# EAGLE design v2_power_board (EAGLE 9.6.2)
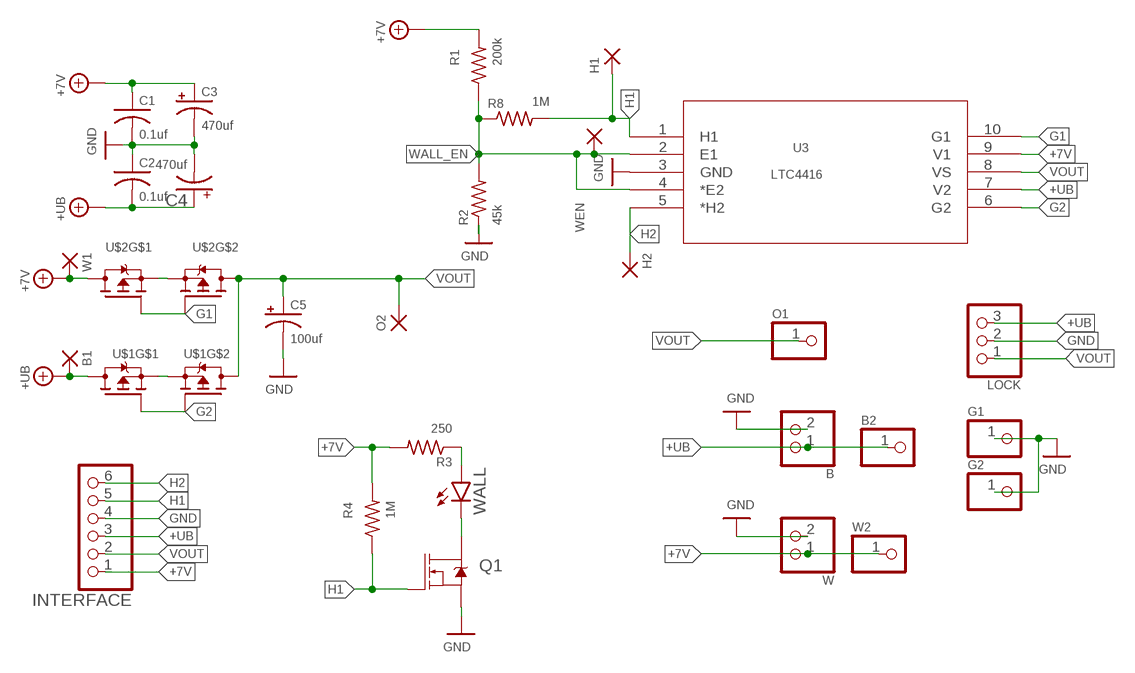
[diagram p0: schematic, sheet 1]

## Parts
B  PINHD-1X2  [1X02]
B1  SMD2  [SMD1,27-2,54]
B2  PINHD-1X1  [1X01]
C1  0.1uf  C-USC0805  [C0805]
C2  0.1uf  C-USC0805  [C0805]
C3  470uf  CPOL-US140CLH-0810  [140CLH-0810]
C4  470uf  CPOL-US140CLH-0810  [140CLH-0810]
C5  100uf  CPOL-US140CLH-0810  [140CLH-0810]
G1  PINHD-1X1  [1X01]
G2  PINHD-1X1  [1X01]
H1  SMD2  [SMD1,27-2,54]
H2  SMD2  [SMD1,27-2,54]
INTERFACE  PINHD-1X6  [1X06]
LOCK  PINHD-1X3  [1X03]
O1  PINHD-1X1  [1X01]
O2  SMD2  [SMD1,27-2,54]
Q1  310mA/60V/1.6Ω  MOSFET-NCH-2N7002PW  [SOT323]
R1  200k  R-US_R0805  [R0805]
R2  45k  R-US_R0805  [R0805]
R3  250  R-US_R0805  [R0805]
R4  1M  R-US_R0805  [R0805]
R8  1M  R-US_R0805  [R0805]
U3  LTC4416  LTC4416IMS#PBF  [MSOP-10_MS]
U$1  IRF7314PBF  [SO-8]
U$2  IRF7314PBF  [SO-8]
W  PINHD-1X2  [1X02]
W1  SMD2  [SMD1,27-2,54]
W2  PINHD-1X1  [1X01]
WALL  LEDSML0805  [SML0805]
WEN  SMD2  [SMD1,27-2,54]

## Nets
+7V: C1.1 C3.+ INTERFACE.1 R1.2 R3.2 R4.2 U3.9(V1) U$2.7(D) U$2.8(D) W1.1(P) W2.1 W.1
+UB: B1.1(P) B2.1 B.1 C2.2 C4.+ INTERFACE.3 LOCK.3 U3.7(V2) U$1.7(D) U$1.8(D)
G1: U3.10(G1) U$2.2(G) U$2.4(G)
G2: U3.6(G2) U$1.2(G) U$1.4(G)
GND: B.2 C1.2 C2.1 C3.- C4.- C5.- G1.1 G2.1 INTERFACE.4 LOCK.2 Q1.2(S) R2.1 U3.3(GND) W.2
H1: H1.1(P) INTERFACE.5 Q1.1(G) R4.1 R8.2 U3.1(H1)
H2: H2.1(P) INTERFACE.6 U3.5(*H2)
N$1: R3.1 WALL.A
N$2: Q1.3(D) WALL.C
N$3: U$1.1(S) U$1.3(S)
N$4: U$2.1(S) U$2.3(S)
VOUT: C5.+ INTERFACE.2 LOCK.1 O1.1 O2.1(P) U3.8(VS) U$1.5(D) U$1.6(D) U$2.5(D) U$2.6(D)
WALL_EN: R1.1 R2.2 R8.1 U3.2(E1) U3.4(*E2) WEN.1(P)

## Library data of the parts
B W = pinhead:PINHD-1X2: PIN HEADER
B1 H1 H2 O2 W1 WEN = wirepad:SMD2: SMD PAD
B2 G1 G2 O1 W2 = pinhead:PINHD-1X1: PIN HEADER
C1 C2 = rcl:C-US: CAPACITOR, American symbol; SPICEPREFIX: C
C3-C5 = rcl:CPOL-US: POLARIZED CAPACITOR, American symbol; SPICEPREFIX: C
INTERFACE = pinhead:PINHD-1X6: PIN HEADER
LOCK = pinhead:PINHD-1X3: PIN HEADER
Q1 = SparkFun-DiscreteSemi:MOSFET-NCH: N-channel MOSFETs Voltage controlled devices that allow control of high current outputs. SparkFun Products: SparkFun OpenScale <https://www.sparkfun.com/products/13261> SparkFun Digital Sandbox <https://www.sparkfun.com/products/12651> SparkFun Monster Moto Shield <https://www.sparkfun.com/products/10182> SparkFun MOSFET Power Controller <https://www.sparkfun.com/products/11214>; PROD_ID: TRANS-11151
R1-R4 R8 = rcl:R-US_: RESISTOR, American symbol; SPICEPREFIX: R
U3 = LTC4416IMS_PBF:LTC4416IMS#PBF: Check availability <https://pricing.snapeda.com/parts/LTC4416IMS%23PBF/Analog%20Devices/view-part?ref=eda>; AVAILABILITY: In Stock; DESCRIPTION: OR Controller Source Selector Switch P-Channel 2:2 10-MSOP; MF: Analog Devices; MP: LTC4416IMS#PBF; PACKAGE: MSOP-10 Linear Technology; PRICE: None; PURCHASE-URL: https://pricing.snapeda.com/search/part/LTC4416IMS#PBF/?ref=eda
U$1 U$2 = IRF7314PBF:IRF7314PBF: Check availability <https://pricing.snapeda.com/parts/IRF7314PBF/Infineon/view-part?ref=eda>; AVAILABILITY: In Stock; DESCRIPTION: Mosfet Array 2 P-Channel (Dual) 20V 5.3A 2W Surface Mount 8-SO; MF: Infineon; MP: IRF7314PBF; PACKAGE: SOIC-8 International Rectifier; PRICE: None; PURCHASE-URL: https://pricing.snapeda.com/search/part/IRF7314PBF/?ref=eda
WALL = led:LED: LED OSRAM: - CHIPLED LG R971, LG N971, LY N971, LG Q971, LY Q971, LO R971, LY R971 LH N974, LH R974 LS Q976, LO Q976, LY Q976 LO Q996 - Hyper CHIPLED LW Q18S LB Q993, LB Q99A, LB R99A - SideLED LS A670, LO A670, LY A670, LG A670, LP A670 LB A673, LV A673, LT A673, LW A673 LH A674 LY A675 LS A676, LA A676, LO A676, LY A676, LW A676 LS A679, LY A679, LG A679 - Hyper Micro SIDELED® LS Y876, LA Y876, LO Y876, LY Y876 LT Y87S - SmartLED LW L88C, LW L88S LB L89C, LB L89S, LG L890 LS L89K, LO L89K, LY L89K LS L896, LA L896, LO L896, LY L896 - TOPLED LS T670, LO T670, LY T670, LG T670, LP T670 LSG T670, LSP T670, LSY T670, LOP T670, LYG T670 LG T671, LOG T671, LSG T671 LB T673, LV T673, LT T673, LW T673 LH T674 LS T676, LA T676, LO T676, LY T676, LB T676, LH T676, LSB T676, LW T676 LB T67C, LV T67C, LT T67C, LS T67K, LO T67K, LY T67K, LW E67C LS E67B, LA E67B, LO E67B, LY E67B, LB E67C, LV E67C, LT E67C LW T67C LS T679, LY T679, LG T679 LS T770, LO T770, LY T770, LG T770, LP T770 LB T773, LV T773, LT T773, LW T773 LH T774 LS E675, LA E675, LY E675, LS T675 LS T776, LA T776, LO T776, LY T776, LB T776 LHGB T686 LT T68C, LB T68C - Hyper Mini TOPLED® LB M676 - Mini TOPLED Santana® LG M470 LS M47K, LO M47K, LY M47K Source: http://www.osram.convergy.de LUXEON: - LUMILED® LXK2-PW12-R00, LXK2-PW12-S00, LXK2-PW14-U00, LXK2-PW14-V00 LXK2-PM12-R00, LXK2-PM12-S00, LXK2-PM14-U00 LXK2-PE12-Q00, LXK2-PE12-R00, LXK2-PE12-S00, LXK2-PE14-T00, LXK2-PE14-U00 LXK2-PB12-K00, LXK2-PB12-L00, LXK2-PB12-M00, LXK2-PB14-N00, LXK2-PB14-P00, LXK2-PB14-Q00 LXK2-PR12-L00, LXK2-PR12-M00, LXK2-PR14-Q00, LXK2-PR14-R00 LXK2-PD12-Q00, LXK2-PD12-R00, LXK2-PD12-S00 LXK2-PH12-R00, LXK2-PH12-S00 LXK2-PL12-P00, LXK2-PL12-Q00, LXK2-PL12-R00 Source: www.luxeon.com KINGBRIGHT: KA-3528ASYC Source: www.kingbright.com

## Board
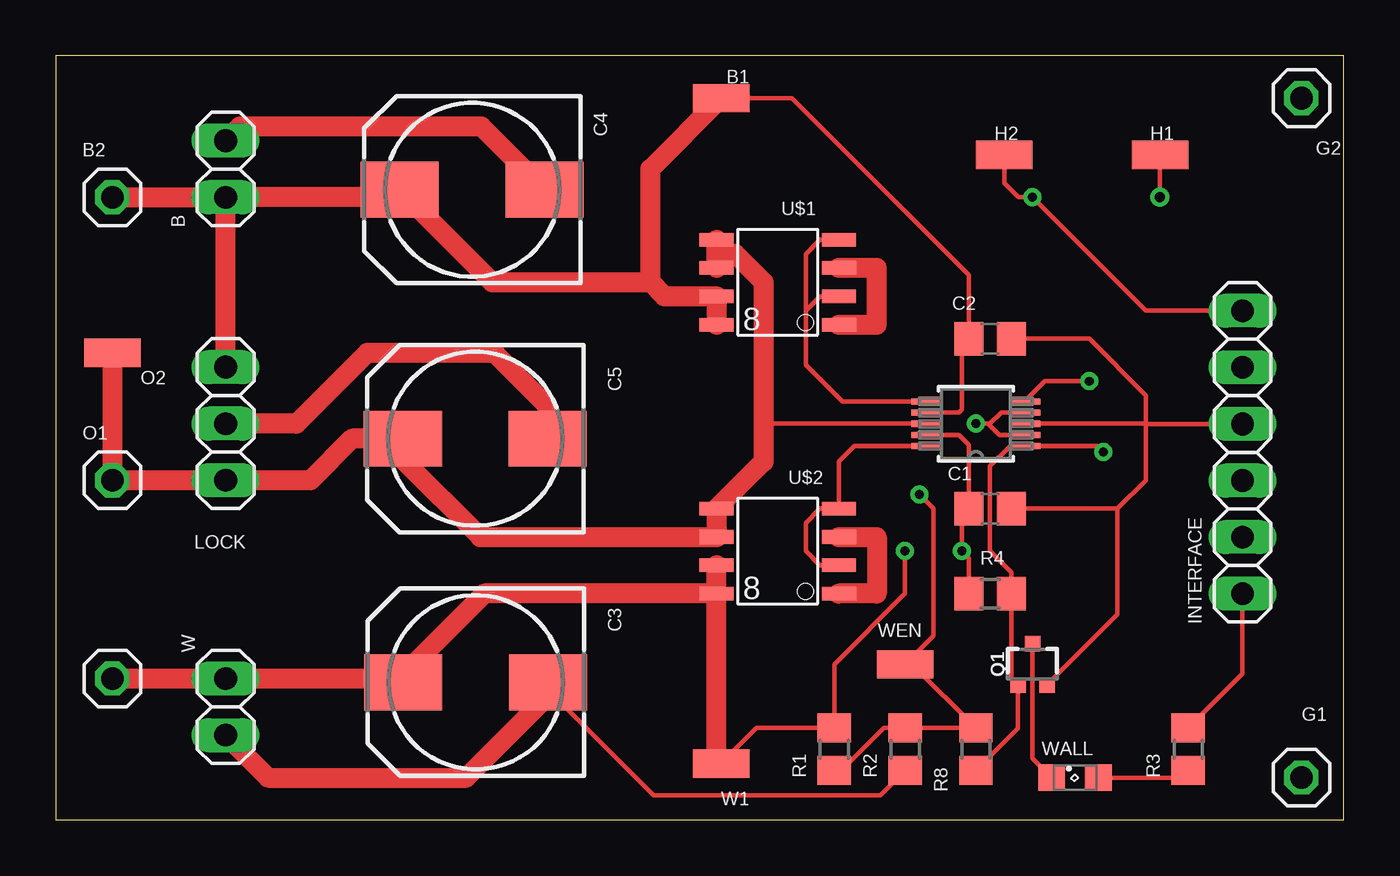
[diagram p1: board, top side]
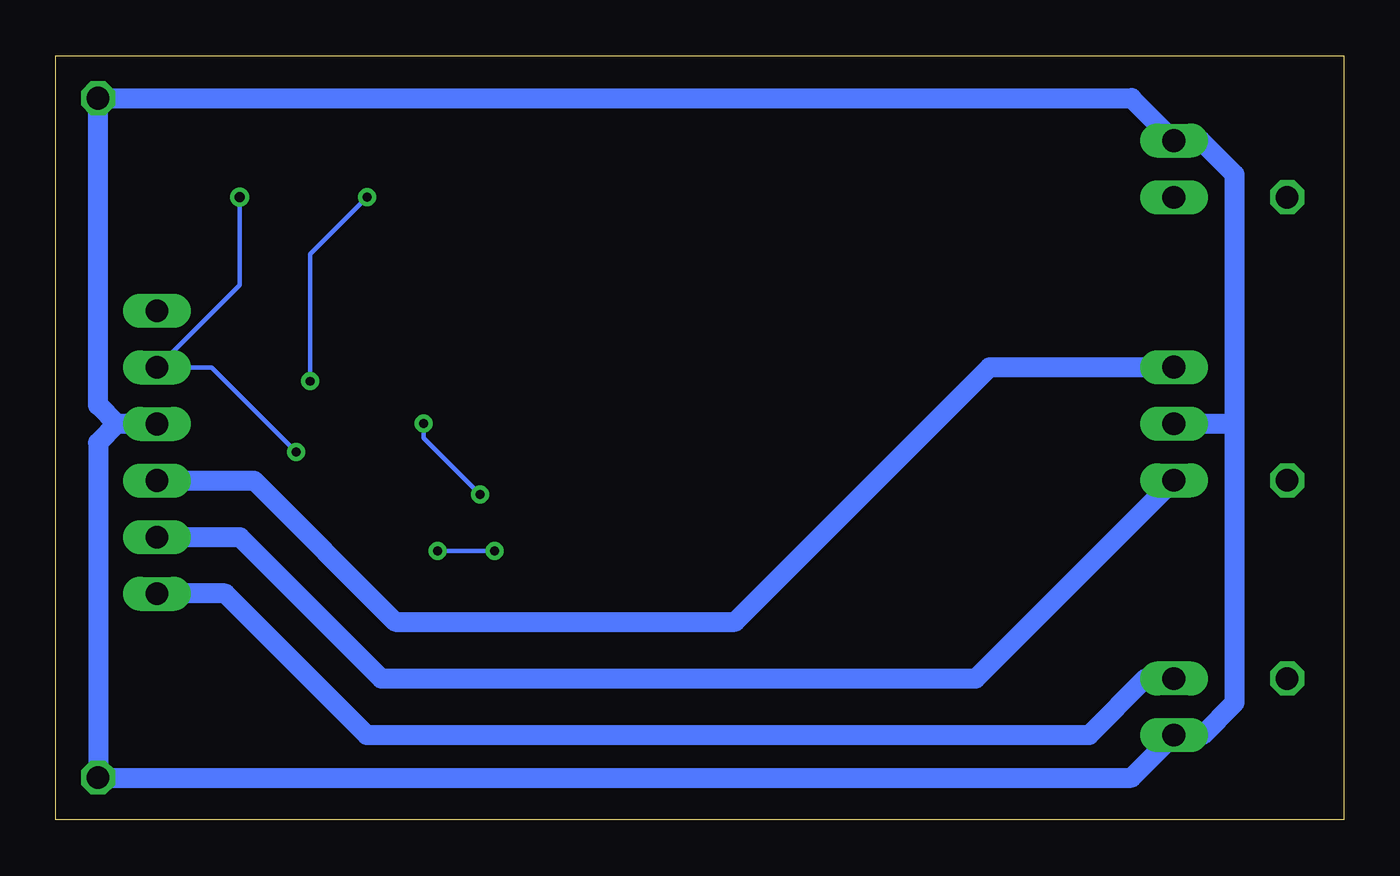
[diagram p2: board, bottom side, seen from below]

Size 57.77 x 34.29 mm. Coordinates in mm from the lower left corner, seen from the top.
Outline: 0,0 57.77,0 57.77,34.29 0,34.29 0,0
Copper layers (1*16): Top 0.035mm / dielectric 1.5mm / Bottom 0.035mm
Design rules "default": minimum track width 6mil, minimum drill 0.35mm, track to track 6mil, track to pad 6mil, pad to pad 6mil, via to via 6mil, smd to smd 6mil, copper to edge 40mil, drill to drill 6mil, minimum pad ring 10mil, minimum via ring 8mil, stop-mask expansion 4mil, vias tented up to drill 0mil, thermal gap 10mil

### Footprints (pad centres in the part's own frame; a part is rotated, then mirrored left to right if it is on the bottom)
1X02 = drill 1.016 long: 1 -1.27,0; 2 1.27,0
SMD1,27-2,54 = smd 1.27 x 2.54: 1 0,0
1X01 = drill 1.016 octagon: 1 0,0
C0805 = smd 1.3 x 1.5: 1 -0.95,0; 2 0.95,0
140CLH-0810 = smd 3.5 x 2.5: + 3.25,0; - -3.25,0
1X06 = drill 1.016 long: 1 -6.35,0; 2 -3.81,0; 3 -1.27,0; 4 1.27,0; 5 3.81,0; 6 6.35,0
1X03 = drill 1.016 long: 1 -2.54,0; 2 0,0; 3 2.54,0
SOT323 = smd 0.7 x 0.7: 1 -0.65,-0.925; 2 0.65,-0.925; 3 0,0.925
R0805 = smd 1.3 x 1.5: 1 -0.95,0; 2 0.95,0
MSOP-10_MS = smd 1.397 x 0.279: 1 -2.184,1.001; 2 -2.184,0.5; 3 -2.184,0; 4 -2.184,-0.5; 5 -2.184,-1.001; 6 2.184,-1.001; 7 2.184,-0.5; 8 2.184,0; 9 2.184,0.5; 10 2.184,1.001
SO-8 = smd 1.524 x 0.61: 1 -2.743,1.905; 2 -2.743,0.635; 3 -2.743,-0.635; 4 -2.743,-1.905; 5 2.743,-1.905; 6 2.743,-0.635; 7 2.743,0.635; 8 2.743,1.905
SML0805 = smd 1.2 x 1.2: A 1.05,0; C -1.05,0

### Placement (x,y rotation side)
B  7.62,29.21 90 top
B1  29.84,32.38 90 top
B2  2.54,27.94 0 top
C1  41.91,13.97 0 top
C2  41.91,21.59 180 top
C3  18.84,6.18 180 top
C4  18.68,28.28 180 top
C5  18.82,17.11 180 top
G1  55.88,1.91 0 top
G2  55.88,32.38 0 top
H1  49.53,29.84 90 top
H2  42.55,29.84 90 top
INTERFACE  53.23,16.5 90 top
LOCK  7.62,17.78 90 top
O1  2.54,15.24 0 top
O2  2.54,20.95 90 top
Q1  43.81,6.99 0 top
R1  34.92,3.17 90 top
R2  38.1,3.17 90 top
R3  50.8,3.17 90 top
R4  41.91,10.16 180 top
R8  41.27,3.17 270 top
U3  41.27,17.78 180 top
U$1  32.38,24.13 180 top
U$2  32.38,12.06 180 top
W  7.62,5.08 270 top
W1  29.84,2.54 90 top
W2  2.54,6.35 0 top
WALL  45.72,1.91 0 top
WEN  38.1,6.99 270 top

### Tracks (layer width: path | path; a pad name or v marks a point on that pad's centre or on a via)
+7V  (via drill 0.4)
  Top 0.203: W1.1 31.43,4.12 R1.2 34.92,6.99 38.1,10.16 v38.1,12.06 | R3.2 53.23,6.55 INTERFACE.1 | U3.9 40.51,17.28 40.96,16.82 C1.1 40.64,13.65 v40.64,12.06 40.96,11.74 R4.2
  Top 0.889: W2.1 W.1 15.42,6.35 | 15.42,6.35 C3.+ | 15.42,6.35 19.23,10.16 U$2.8 | W1.1 29.64,2.74 U$2.8 | U$2.8 U$2.7
  Bottom 0.203: v40.64,12.06 v38.1,12.06
  Bottom 0.889: W.1 8.89,6.35 11.43,3.81 43.81,3.81 50.16,10.16 INTERFACE.1
+UB
  Top 0.203: B1.1 33.02,32.38 40.96,24.45 C2.2 40.64,21.27 40.64,18.41 40.51,18.28 U3.7
  Top 0.889: B.1 15.09,27.94 C4.+ 19.58,24.13 26.67,24.13 | LOCK.3 B.1 | 26.67,24.13 26.67,29.21 B1.1 | B2.1 B.1 | U$1.8 U$1.7 27.3,23.5 26.67,24.13
  Bottom 0.889: LOCK.3 15.88,20.32 27.3,8.89 42.55,8.89 48.88,15.23 INTERFACE.3
G1
  Top 0.203: U$2.2 34.29,11.43 33.66,12.06 33.66,13.34 34.29,13.97 U$2.4 35.13,16.08 35.83,16.78 U3.10
G2
  Top 0.203: U3.6 35.28,18.78 33.66,20.41 33.66,22.86 | 33.66,22.86 34.29,23.5 U$1.2 | 33.66,22.86 33.66,25.4 34.29,26.04 U$1.4
GND
  Top 0.203: C2.1 46.35,21.59 48.9,19.05 48.9,17.78 | INTERFACE.4 48.91,17.77 48.9,17.78 | 48.9,17.78 U3.3 | 47.62,13.97 48.9,15.24 48.9,17.78 | C1.2 47.62,13.97 | R2.1 36.99,1.12 26.82,1.12 22.09,5.85 C3.- | Q1.2 47.62,9.22 47.62,13.97
  Top 0.889: C5.- 22.07,18.57 19.68,20.95 13.97,20.95 10.79,17.78 LOCK.2 | C4.- 19.09,31.11 8.26,31.11 B.2 | W.2 9.53,1.91 18.41,1.91 22.09,5.58 C3.-
  Bottom 0.889: 4.89,17.78 4.89,28.96 6.41,30.48 B.2 9.53,32.38 G2.1 55.88,18.62 55.03,17.77 | 4.89,17.78 4.89,5.27 6.35,3.81 W.2 9.53,1.91 G1.1 55.88,16.92 55.03,17.77 | LOCK.2 4.89,17.78 | INTERFACE.4 55.03,17.77
H1  (via drill 0.4, 0.45)
  Top 0.203: H1.1 v49.53,27.94 | 41.59,2.54 R8.2 43.16,4.12 Q1.1 42.86,6.37 R4.1 42.86,11.12 41.91,12.06 41.91,15.88 42.81,16.78 U3.1 46.72,16.78 v46.99,16.51
  Bottom 0.203: v49.53,27.94 49.53,24.01 INTERFACE.5 50.79,20.31 v46.99,16.51
H2  (via drill 0.4)
  Top 0.203: H2.1 42.55,28.57 43.18,27.94 v43.81,27.94 48.91,22.85 INTERFACE.6 | U3.5 44.36,19.68 v46.35,19.68
  Bottom 0.203: v46.35,19.68 46.35,25.4 v43.81,27.94
N$1
  Top 0.203: R3.1 50.48,1.91 WALL.A
N$2
  Top 0.203: WALL.C 43.81,2.76 Q1.3
N$3
  Top 0.889: U$1.1 36.83,22.23 36.83,24.77 U$1.3
N$4
  Top 0.889: U$2.3 36.83,12.7 36.83,10.16 U$2.1
VOUT
  Top 0.203: U3.8 31.75,17.78
  Top 0.889: U$1.6 29.64,25.4 | 29.64,25.4 U$1.5 | O2.1 O1.1 LOCK.1 11.43,15.24 13.3,17.11 C5.+ 15.57,16.18 19.05,12.7 U$2.6 U$2.5 31.75,16.08 31.75,17.78 31.75,24.13 30.48,25.4 29.64,25.4
  Bottom 0.889: LOCK.1 16.51,6.35 43.18,6.35 49.52,12.69 INTERFACE.2
WALL_EN  (via drill 0.4)
  Top 0.203: R1.1 35.24,2.23 37.15,4.12 R2.2 R8.1 38.41,6.99 WEN.1 39.37,8.26 39.37,13.97 v38.73,14.61 | 41.91,17.78 42.41,18.28 U3.4 | 41.91,17.78 41.86,17.73 42.32,17.28 U3.2 | v41.27,17.78 41.91,17.78
  Bottom 0.203: v38.73,14.61 41.27,17.14 v41.27,17.78